# EAGLE design ublox (EAGLE 6.1)
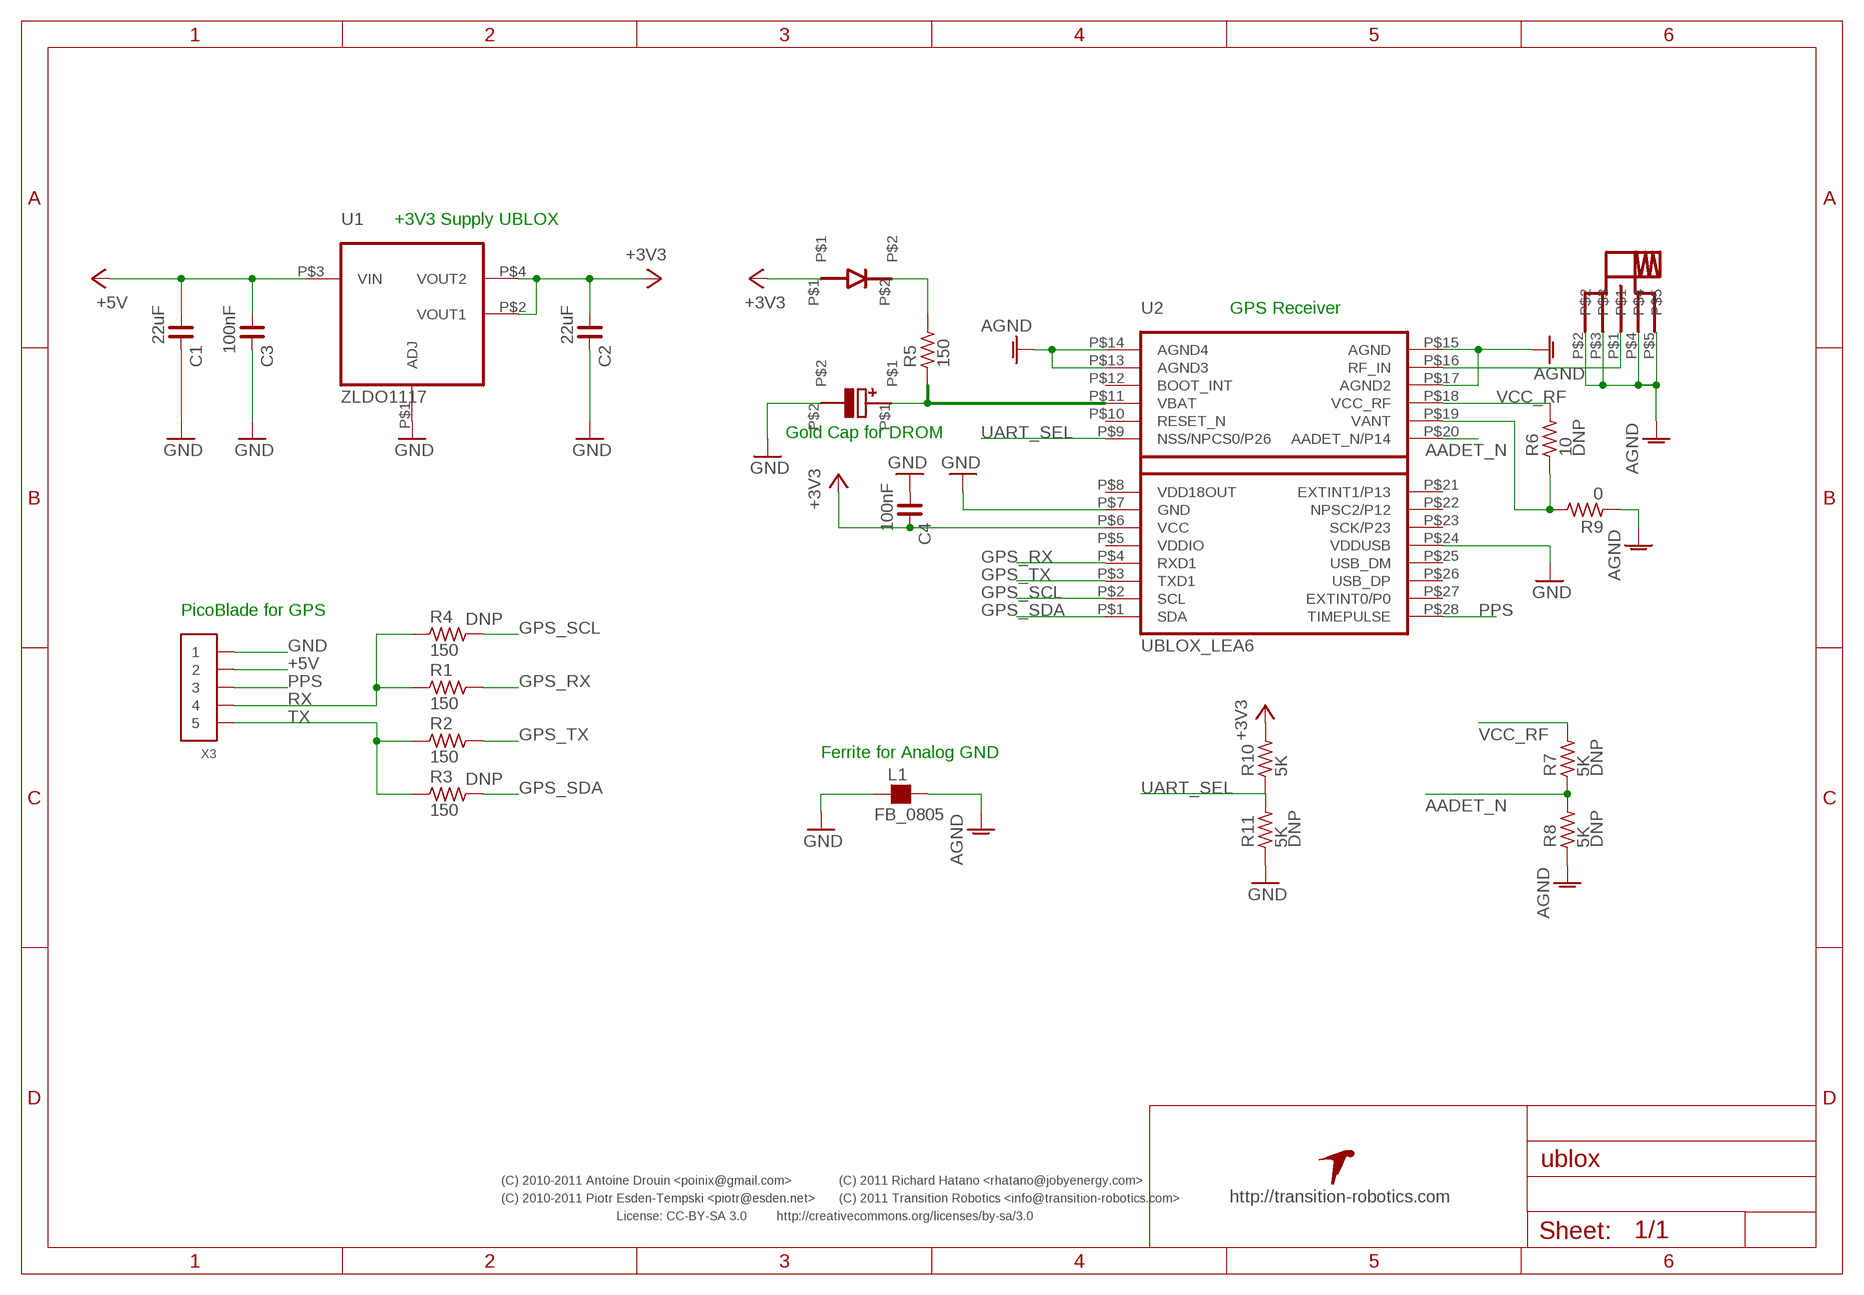
[diagram p0: schematic, sheet 1]

## Parts
C1  22uF  C_0805  [C0805]
C2  22uF  C_0805  [C0805]
C3  100nF  C_0805  [C0805]
C4  100nF  C_0805  [C0805]
C5  EECEN0F204AK  [EECEN0F204AK]
D1  SOD123  [SOD123]
J1  SMA  [SMA]
L1  FB_0805  [L0805]
R1  150  R_0603  [R0603]
R2  150  R_0603  [R0603]
R3  150  R_0603  [R0603]
R4  150  R_0603  [R0603]
R5  150  R_0603  [R0603]
R6  10  R_0603  [R0603]
R7  5K  R_0603  [R0603]
R8  5K  R_0603  [R0603]
R9  0  R_0603  [R0603]
R10  5K  R_0603  [R0603]
R11  5K  R_0603  [R0603]
U1  ZLDO1117  [ZLDO1117]
U2  UBLOX_LEA6  [UBLOX_LEA6]
U$1  TR-LOGO  [TR-LOGO]
X3  CONN_5-1-53261  [PB-53261-05]

## Nets
+3V3: C2.1 C4.2 D1.P$1 R10.2 U1.P$2(VOUT1) U1.P$4(VOUT2) U2.P$6(VCC)
+5V: C1.1 C3.1 U1.P$3(VIN) X3.2
AADET_N: R7.1 R8.2 U2.P$20(AADET_N/P14)
AGND: J1.P$2 J1.P$3 J1.P$4 J1.P$5 L1.2 R8.1 R9.1 U2.P$13(AGND3) U2.P$14(AGND4) U2.P$15(AGND) U2.P$17(AGND2)
GND: C1.2 C2.2 C3.2 C4.1 C5.P$2 L1.1 R11.1 U1.P$1(ADJ) U2.P$7(GND) U2.P$24(VDDUSB) X3.1
GPS_RX: R1.2 U2.P$4(RXD1)
GPS_SCL: R4.2 U2.P$2(SCL)
GPS_SDA: R3.2 U2.P$1(SDA)
GPS_TX: R2.2 U2.P$3(TXD1)
N$1: R10.1 R11.2
N$3: D1.P$2 R5.2
N$4: C5.P$1 R5.1 U2.P$11(VBAT)
N$6: J1.P$1 U2.P$16(RF_IN)
N$12: R6.1 R9.2 U2.P$19(VANT)
PPS: U2.P$28(TIMEPULSE) X3.3
RX: R1.1 R4.1 X3.4
TX: R2.1 R3.1 X3.5
UART_SEL: U2.P$9(NSS/NPCS0/P26)
VCC_RF: R6.2 R7.2 U2.P$18(VCC_RF)
Unconnected: U2.P$5(VDDIO) U2.P$8(VDD18OUT) U2.P$10(RESET_N) U2.P$12(BOOT_INT) U2.P$21(EXTINT1/P13) U2.P$22(NPSC2/P12) U2.P$23(SCK/P23) U2.P$25(USB_DM) U2.P$26(USB_DP) U2.P$27(EXTINT0/P0)

## Notes on the sheet
- +3V3 Supply UBLOX
- GPS Receiver
- Gold Cap for DROM
- PicoBlade for GPS
- Ferrite for Analog GND
- (C) 2010-2011 Antoine Drouin <poinix@gmail.com> | (C) 2011 Richard Hatano <rhatano@jobyenergy.com>
- (C) 2010-2011 Piotr Esden-Tempski <piotr@esden.net> | (C) 2011 Transition Robotics <info@transition-robotics.com> | http://transition-robotics.com
- License: CC-BY-SA 3.0 | http://creativecommons.org/licenses/by-sa/3.0

## Library data of the parts
C1-C4 = rc-master-smd:C_: NON-POLARIZED CAP
C5 = gold_cap:EECEN0F204AK
D1 = discrete:SOD123
J1 = joby_robotics:SMA
L1 = rc-master-smd:FB_: FERRITE BEAD
R1 R2 R5 R9 R10 = rc-master-smd:R_: RESISTOR
R3 R4 R6-R8 R11 = rc-master-smd:R_: RESISTOR; DNP: T
U1 = joby_robotics:ZLDO1117
U2 = joby_robotics:UBLOX_LEA6
U$1 = quadshot:TR-LOGO; BOM: EXCLUDE; PARTNO: *
X3 = pel_molex:CONN_5-1

## Board
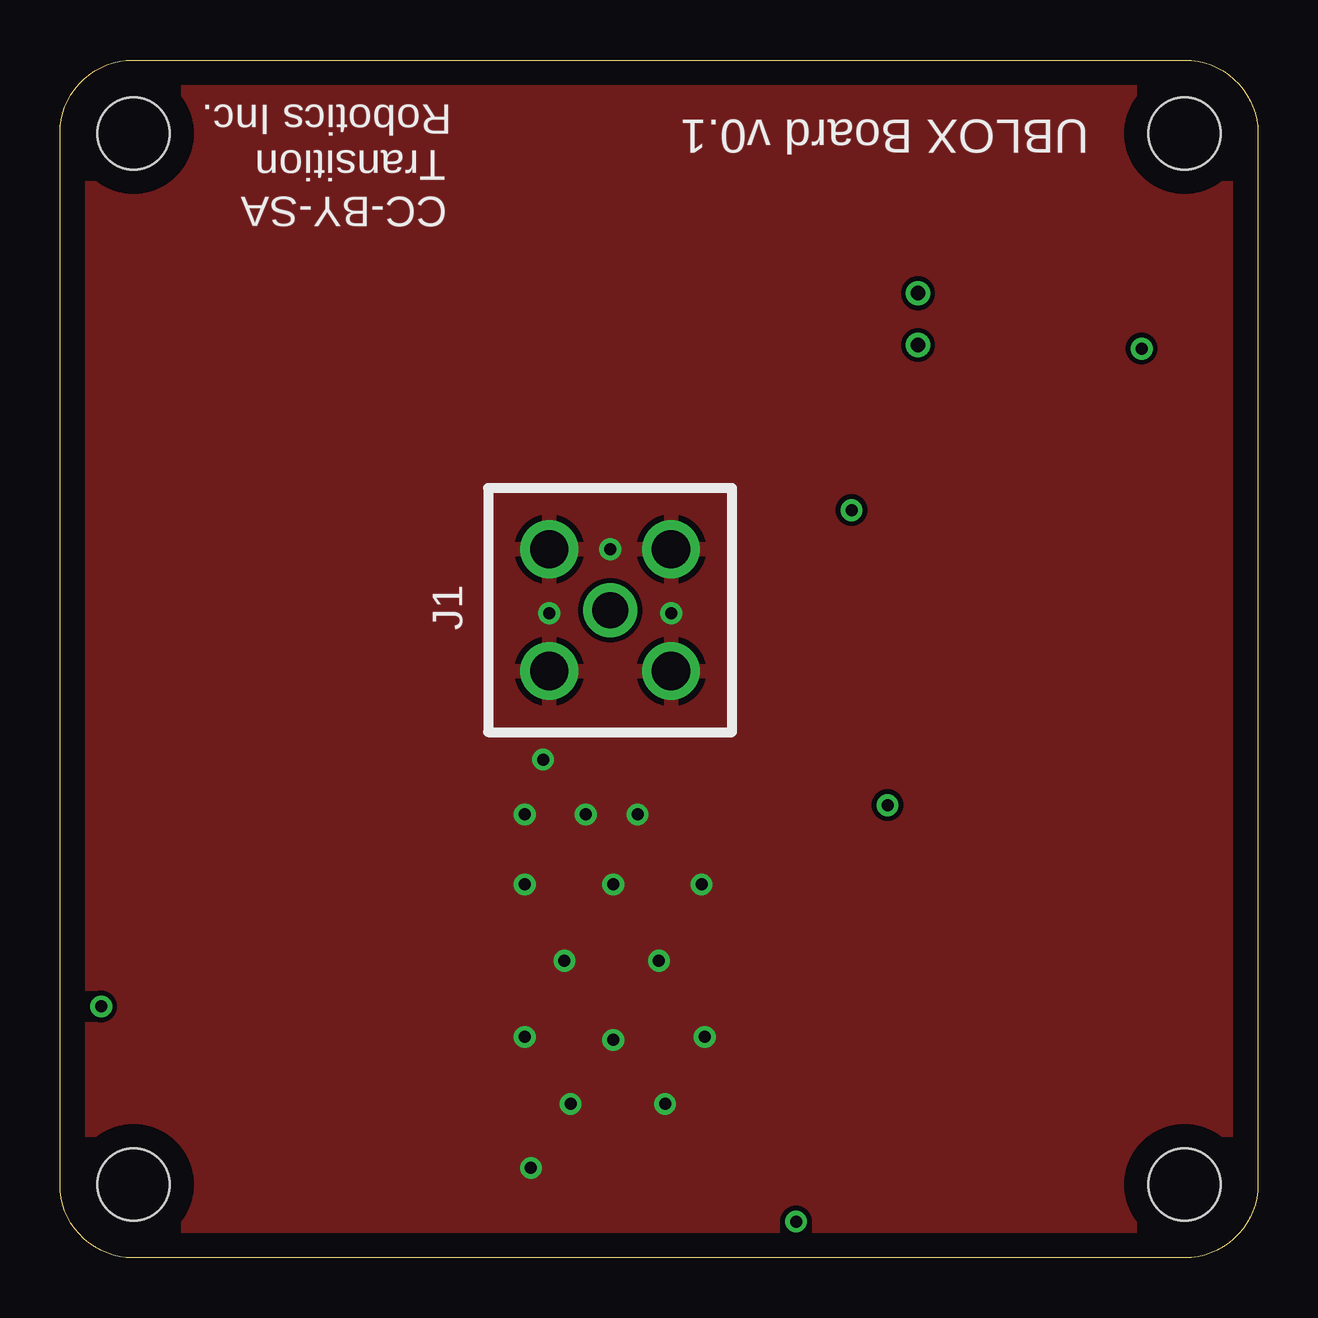
[diagram p1: board, top side]
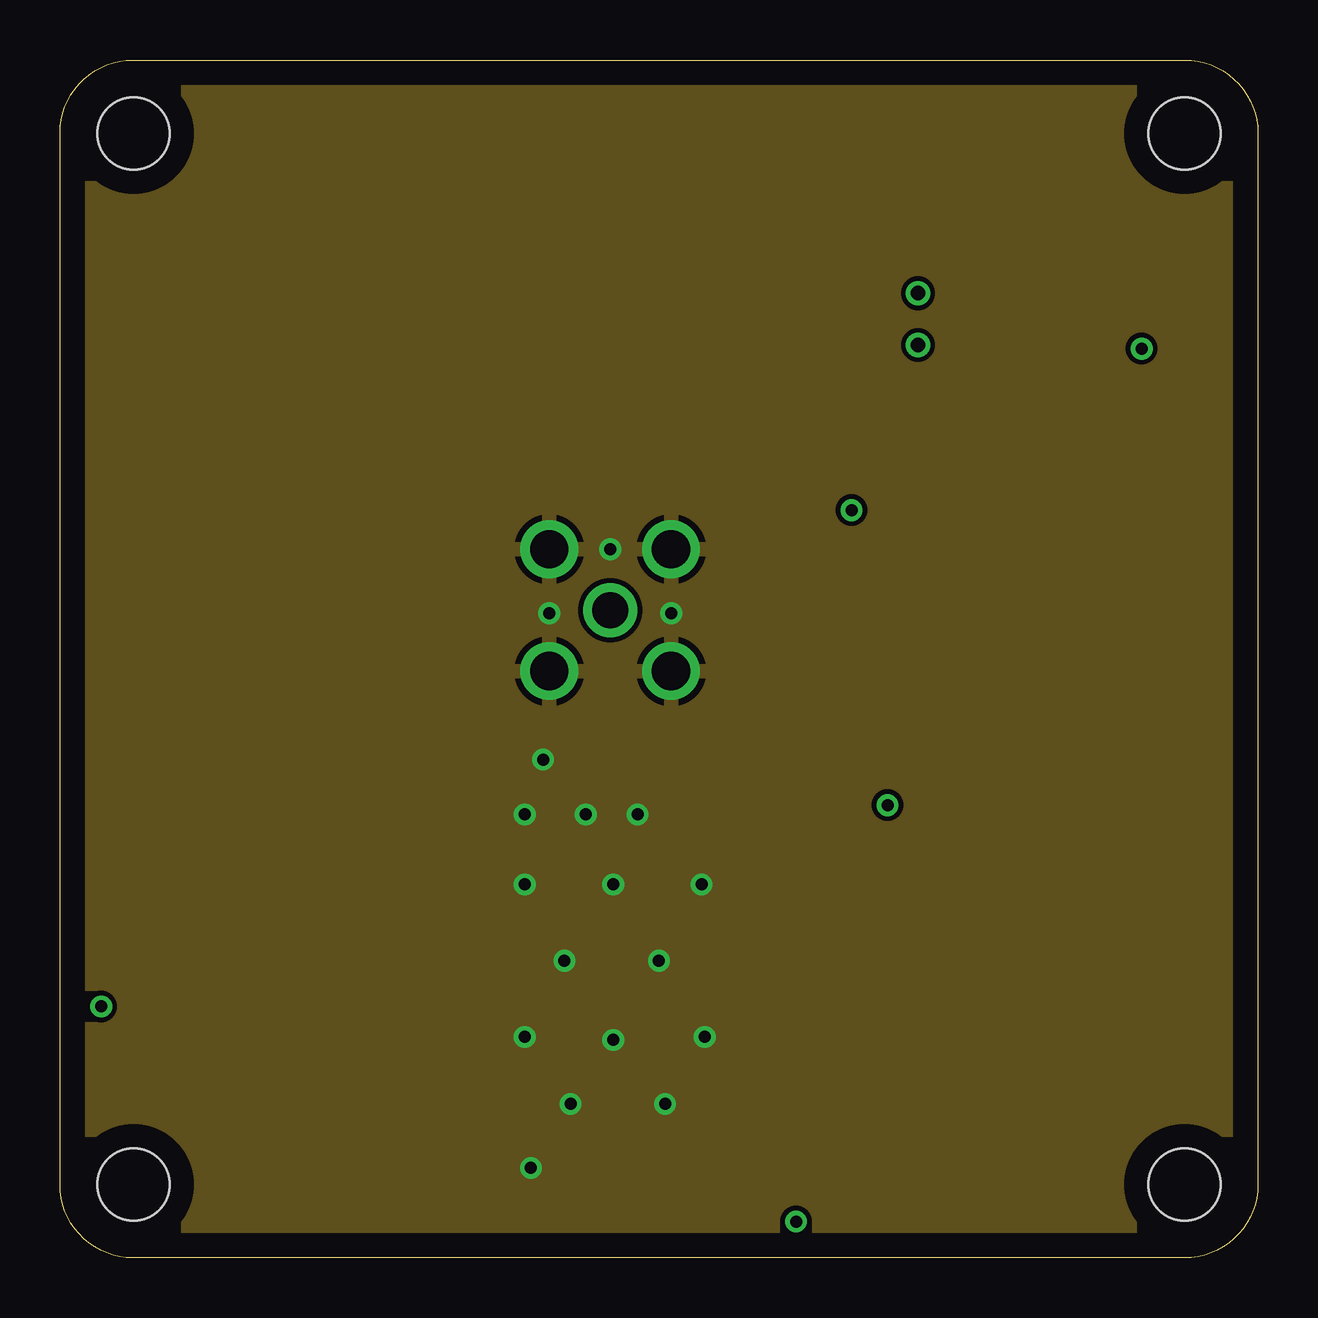
[diagram p2: board, inner layer Route2]
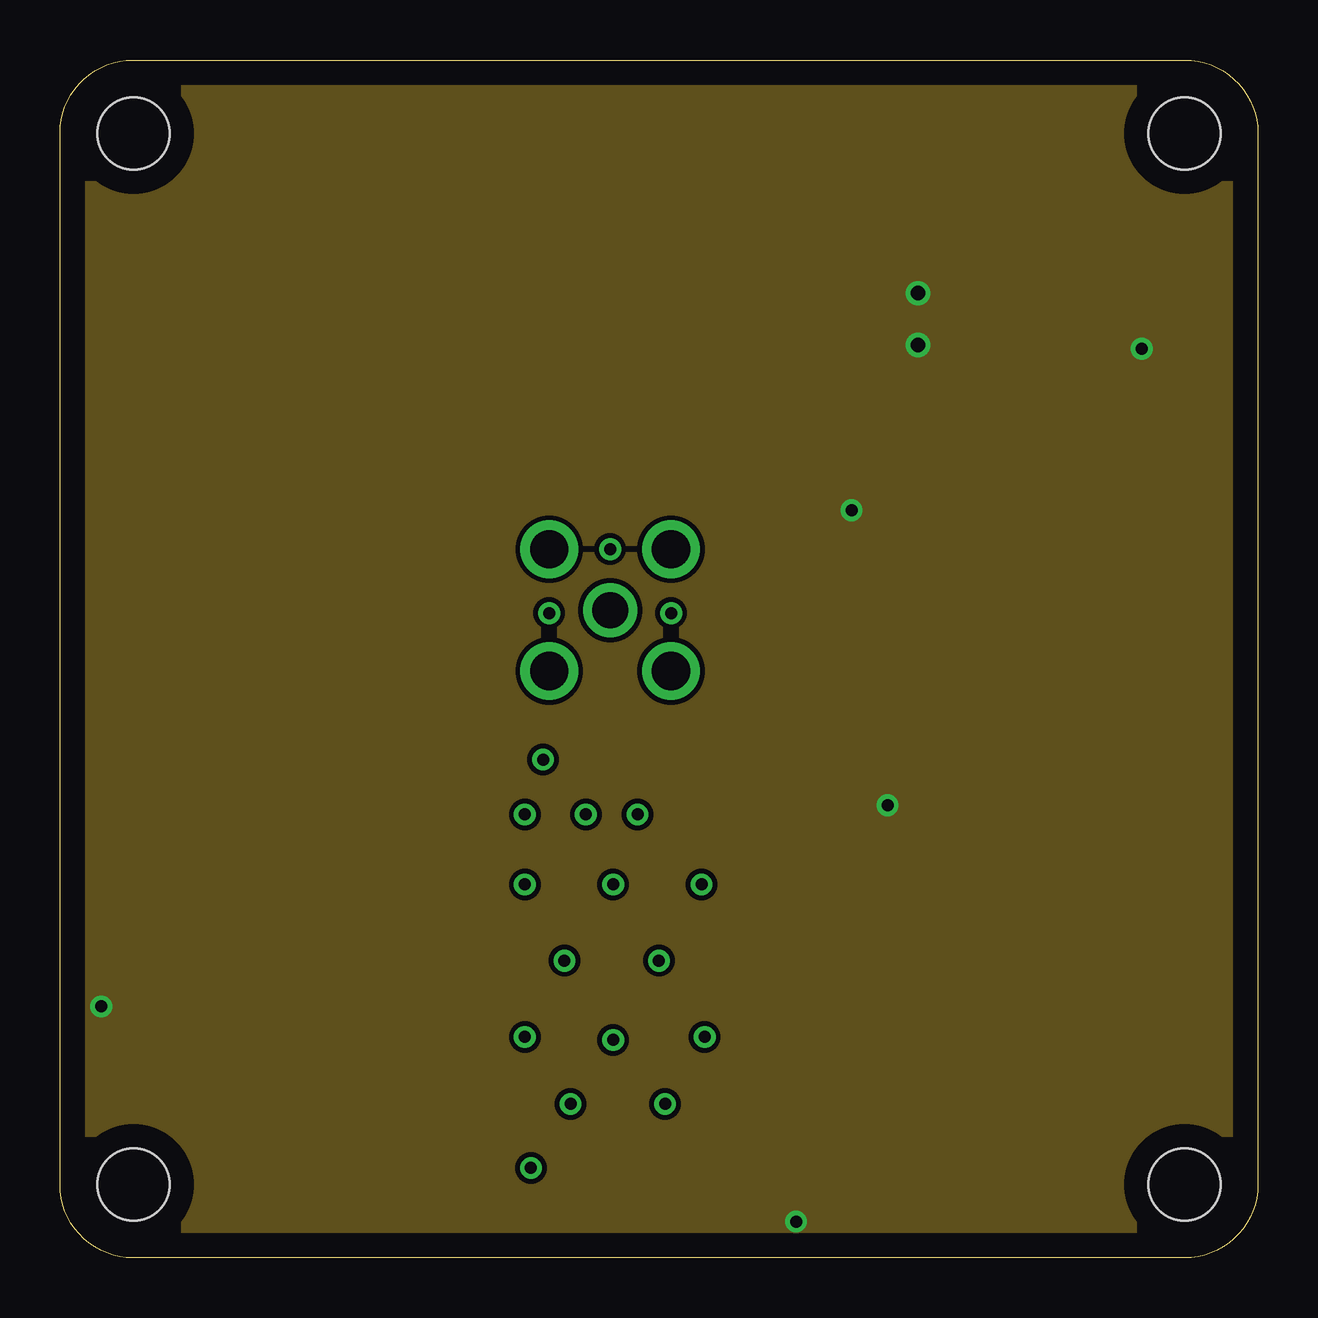
[diagram p3: board, inner layer Route3]
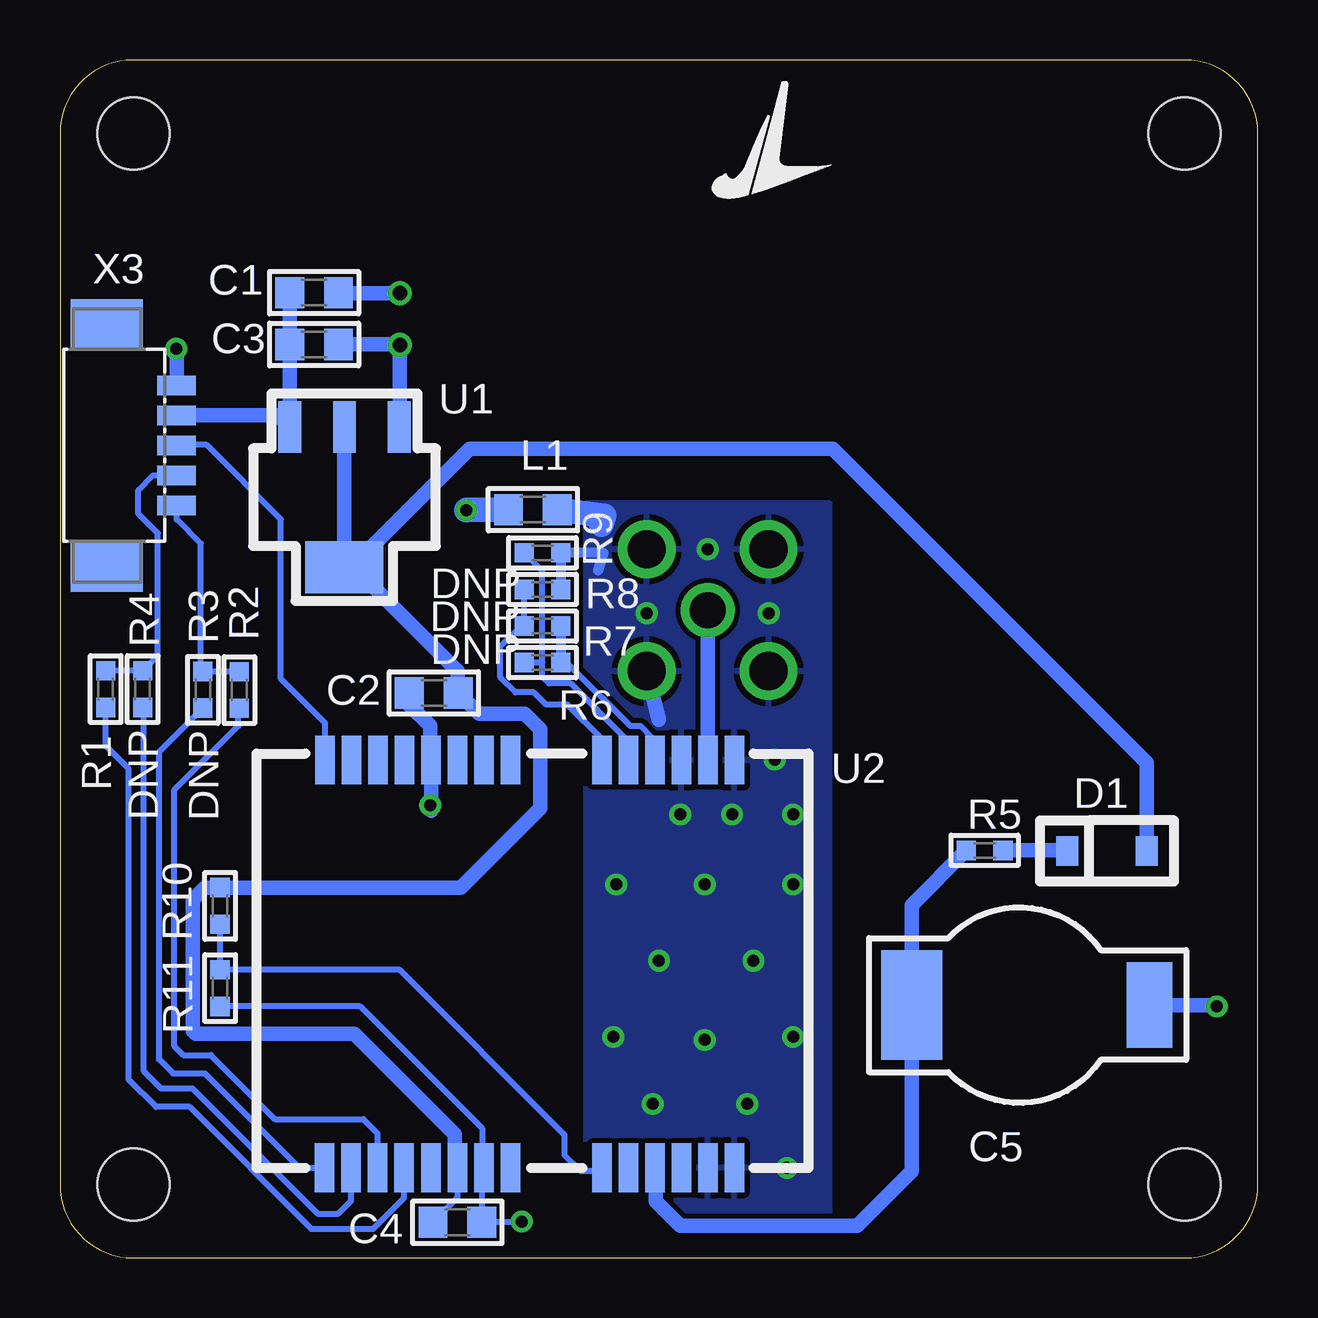
[diagram p4: board, bottom side, seen from below]

Size 49.91 x 49.91 mm. Coordinates in mm from the lower left corner, seen from the top.
Outline: 0,46.86 arc-90 3.05,49.91 46.86,49.91 arc-90 49.91,46.86 49.91,3.05 arc-90 46.86,0 3.05,0 arc-90 0,3.05 0,46.86
Copper layers (1*2*3*16): Top 0.035mm / dielectric 1.5mm / Route2 0.035mm / dielectric 0.15mm / Route3 0.035mm / dielectric 0.2mm / Bottom 0.035mm
Design rules: minimum track width 10mil, minimum drill 15mil, track to track 8mil, track to pad 8mil, pad to pad 8mil, via to via 8mil, smd to smd 8mil, copper to edge 40mil, drill to drill 8mil, minimum pad ring 10mil, minimum via ring 8mil, stop-mask expansion 4mil, vias tented up to drill 20mil, thermal gap 10mil
Holes 3 mm at 46.85,46.85 46.85,3.06 3.06,3.06 3.06,46.85

### Footprints (pad centres in the part's own frame; a part is rotated, then mirrored left to right if it is on the bottom)
C0805 = smd 1.2 x 1.3: 1 -1.016,0; 2 1.016,0
EECEN0F204AK = smd 4.572 x 2.54: P$1 0,4.572 | smd 3.556 x 1.905: P$2 0,-5.334
SOD123 = smd 0.914 x 1.219: P$1 1.651,0; P$2 -1.651,0
SMA = drill 1.499: P$1 0,0 | drill 1.6: P$2 2.54,2.54; P$3 2.54,-2.54; P$4 -2.54,-2.54; P$5 -2.54,2.54
L0805 = smd 1.2 x 1.3: 1 -1.016,0; 2 1.016,0
R0603 = smd 0.8 x 0.8: 1 -0.762,0; 2 0.762,0
ZLDO1117 = smd 0.952 x 2.146: P$1 -2.286,-2.921; P$2 0,-2.921; P$3 2.286,-2.921 | smd 3.251 x 2.159: P$4 0,2.921
UBLOX_LEA6 = smd 2.032 x 0.813: P$1 8.496,-10.763; P$2 8.496,-9.658; P$3 8.496,-8.553; P$4 8.496,-7.449; P$5 8.496,-6.331; P$6 8.496,-5.226; P$7 8.496,-4.121; P$8 8.496,-3.004; P$9 8.496,0.794; P$10 8.496,1.899; P$11 8.496,3.004; P$12 8.496,4.109; P$13 8.496,5.213; P$14 8.496,6.318; P$15 -8.496,6.318; P$16 -8.496,5.213; P$17 -8.496,4.109; P$18 -8.496,3.004; P$19 -8.496,1.899; P$20 -8.496,0.794; P$21 -8.496,-3.004; P$22 -8.496,-4.109; P$23 -8.496,-5.213; P$24 -8.496,-6.318; P$25 -8.496,-7.423; P$26 -8.496,-8.528; P$27 -8.496,-9.633; P$28 -8.496,-10.738
PB-53261-05 = smd 0.8 x 1.6: 1 -2.5,1.1; 2 -1.25,1.1; 3 0,1.1; 4 1.25,1.1; 5 2.5,1.1 | smd 2.1 x 3: MNT1 -5.05,-1.8; MNT2 5.05,-1.8

### Placement (x,y rotation side)
C1  39.32,40.22 0 bottom
C2  34.34,23.54 180 bottom
C3  39.32,38.06 0 bottom
C4  33.35,1.48 180 bottom
C5  9.85,10.53 90 bottom
D1  6.29,16.95 0 bottom
J1  22.92,26.99 0 top
L1  30.2,31.18 0 bottom
R1  48.01,23.7 270 bottom
R2  42.44,23.66 270 bottom
R3  43.96,23.67 270 bottom
R4  46.47,23.7 270 bottom
R5  11.38,16.98 0 bottom
R6  29.81,24.8 0 bottom
R7  29.81,26.33 0 bottom
R8  29.81,27.85 180 bottom
R9  29.81,29.38 180 bottom
R10  43.24,14.67 90 bottom
R11  43.24,11.24 90 bottom
U1  38.06,31.7 180 bottom
U2  28.13,12.25 270 bottom
U$1  20.26,46.6 180 bottom
X3  46.16,33.85 270 bottom

### Tracks (layer width: path | path; a pad name or v marks a point on that pad's centre or on a via)
+3V3
  Bottom 0.254: U2.P$6 33.36,2.5 C4.2
  Bottom 0.61: U1.P$2 U1.P$4 37.77,28.77 | 37.77,28.77 32.83,33.72 17.72,33.72 4.64,20.64 D1.P$1 | U2.P$6 33.46,3.86 33.46,5.14 37.66,9.33 44.26,9.33 44.39,9.46 44.39,14.92 43.88,15.43 R10.2 33.21,15.43 29.91,18.73 29.91,22.03 30.54,22.67 32.45,22.67 C2.1 33.34,23.55 33.34,24.45 37.66,28.77 37.77,28.77
+5V
  Bottom 0.61: X3.2 40.83,35.1 40.77,35.05 | U1.P$3 40.77,35.05 | C1.1 C3.1 40.34,35.48 40.77,35.05
AADET_N
  Bottom 0.254: R8.2 R7.1 30.7,26.33 31.56,25.46 31.56,24.19 30.92,23.56 30.16,23.56 29.65,23.05 28.77,23.05 27.37,21.65 27.37,20.78 U2.P$20
AGND  (via drill 0.5)
  Bottom 0.406: R8.1 R9.1 27.27,29.38 27.5,28.64
  Bottom 0.61: J1.P$3 24.96,22.42
  Bottom 1.016: L1.2 27.24,30.92 27.37,30.54
  other vias: 21.02,12.38 22.92,29.53 20.38,26.86 21.27,6.41 25.46,26.86 26.86,9.21 24.96,12.38 23.05,15.56 20.13,20.76 24.07,18.48 21.91,18.48 26.73,15.56 19.37,18.48 19.62,3.75 19.37,9.21 23.05,9.08 19.37,15.56 25.21,6.41
  pour Bottom: 17.84,31.43 28,31.43 28,18.22 28,5.78 28,0.44 17.84,0.44
  pour Top: 1.08,1.08 48.83,1.08 48.83,48.83 1.08,48.83
  pour Route2: 1.08,48.83 48.83,48.83 48.83,1.08 1.08,1.08
GND  (via drill 0.5, 0.6)
  Bottom 0.254: R11.1 37.4,10.48 32.32,5.4 32.32,3.82 U2.P$7 32.34,3.67 C4.1 32.34,1.35 32.17,1.51 v30.67,1.51
  Bottom 0.61: C2.2 35.35,23.03 34.48,22.16 34.48,20.78 U2.P$24 34.45,18.64 v34.48,18.86 | v35.75,40.2 38.28,40.2 C1.2 | C3.2 36.28,38.06 v35.75,38.04 35.75,35.1 U1.P$1 | C5.P$2 1.77,10.53 v1.71,10.48 | X3.1 45.06,37.87 v45.07,37.88
  Bottom 1.016: L1.1 32.96,31.18 v32.98,31.15
  pour Route3: 1.08,1.08 48.83,1.08 48.83,48.83 1.08,48.83
GPS_RX
  Bottom 0.254: U2.P$4 35.57,2.5 36.87,1.21 39.43,1.21 44.51,6.29 45.91,6.29 47.05,7.43 47.05,20.38 48.01,21.34 R1.2
GPS_SCL
  Bottom 0.254: U2.P$2 37.78,2.37 38.32,1.84 39.18,1.84 44.39,7.05 45.68,7.05 46.42,7.79 46.42,22.86 R4.2
GPS_SDA
  Bottom 0.254: U2.P$1 39.95,3.75 43.88,7.68 45.2,7.68 45.78,8.27 45.78,21.08 R3.2
GPS_TX
  Bottom 0.254: U2.P$3 36.68,5.19 37.27,5.78 40.96,5.78 43.62,8.45 44.77,8.45 45.15,8.83 45.15,19.49 42.48,22.16 42.48,22.85 R2.2
N$1
  Bottom 0.254: R10.1 R11.2 35.75,12 28.92,5.14 28.89,5.12 28.89,4.28 28.23,3.62 27.37,3.62
N$3
  Bottom 0.61: R5.2 7.96,16.98 D1.P$2
N$4
  Bottom 0.61: R5.1 14.43,14.69 C5.P$1 14.42,3.61 16.7,1.33 24.07,1.33 25.08,2.35 25.08,3.71 U2.P$11
N$6
  Bottom 0.61: J1.P$1 U2.P$16
N$12
  Bottom 0.254: R9.2 29.81,28.61 29.81,24.8 | 29.81,24.8 R6.1 | 29.81,24.8 29.81,24.22 29.53,23.94 28.64,23.94 26.35,21.65 U2.P$19
PPS
  Bottom 0.254: U2.P$28 38.87,22.28 38.87,22.29 40.7,24.13 40.7,30.77 43.8,33.87 45.03,33.87 X3.3
RX
  Bottom 0.254: X3.4 46.04,32.6 46.65,31.99 46.65,31 45.83,30.19 45.83,25.09 R4.1 R1.1
TX
  Bottom 0.254: X3.5 45.05,30.77 44.04,29.76 44.04,24.51 R3.1 43.95,24.42 R2.1
VCC_RF
  Bottom 0.254: U2.P$18 25.21,20.83 25.21,21.65 25.72,22.16 26.15,22.16 28.79,24.8 R6.2
  Bottom 0.406: R7.2 R6.2

### Text on the board
tPlace: Robotics Inc. | UBLOX Board v0.1 | Transition | CC-BY-SA
bPlace: DNP | DNP | DNP | DNP | DNP
tNames: J1
bNames: U1
Reference: Licensed under: | (C) 2010-2011 Antoine Drouin <poinix@gmail.com> | (C) 2010-2011 Piotr Esden-Tempski <piotr@esden.net> | CC-BY-SA 3.0 | (C) 2011 Richard Hatano <rhatano@jobyenergy.com> | (C) 2011 Transition Robotics <info@transition-robotics.com> | http://creativecommons.org/licenses/by-sa/3.0/